# Altium schematic sheet main.SchDoc
size A4
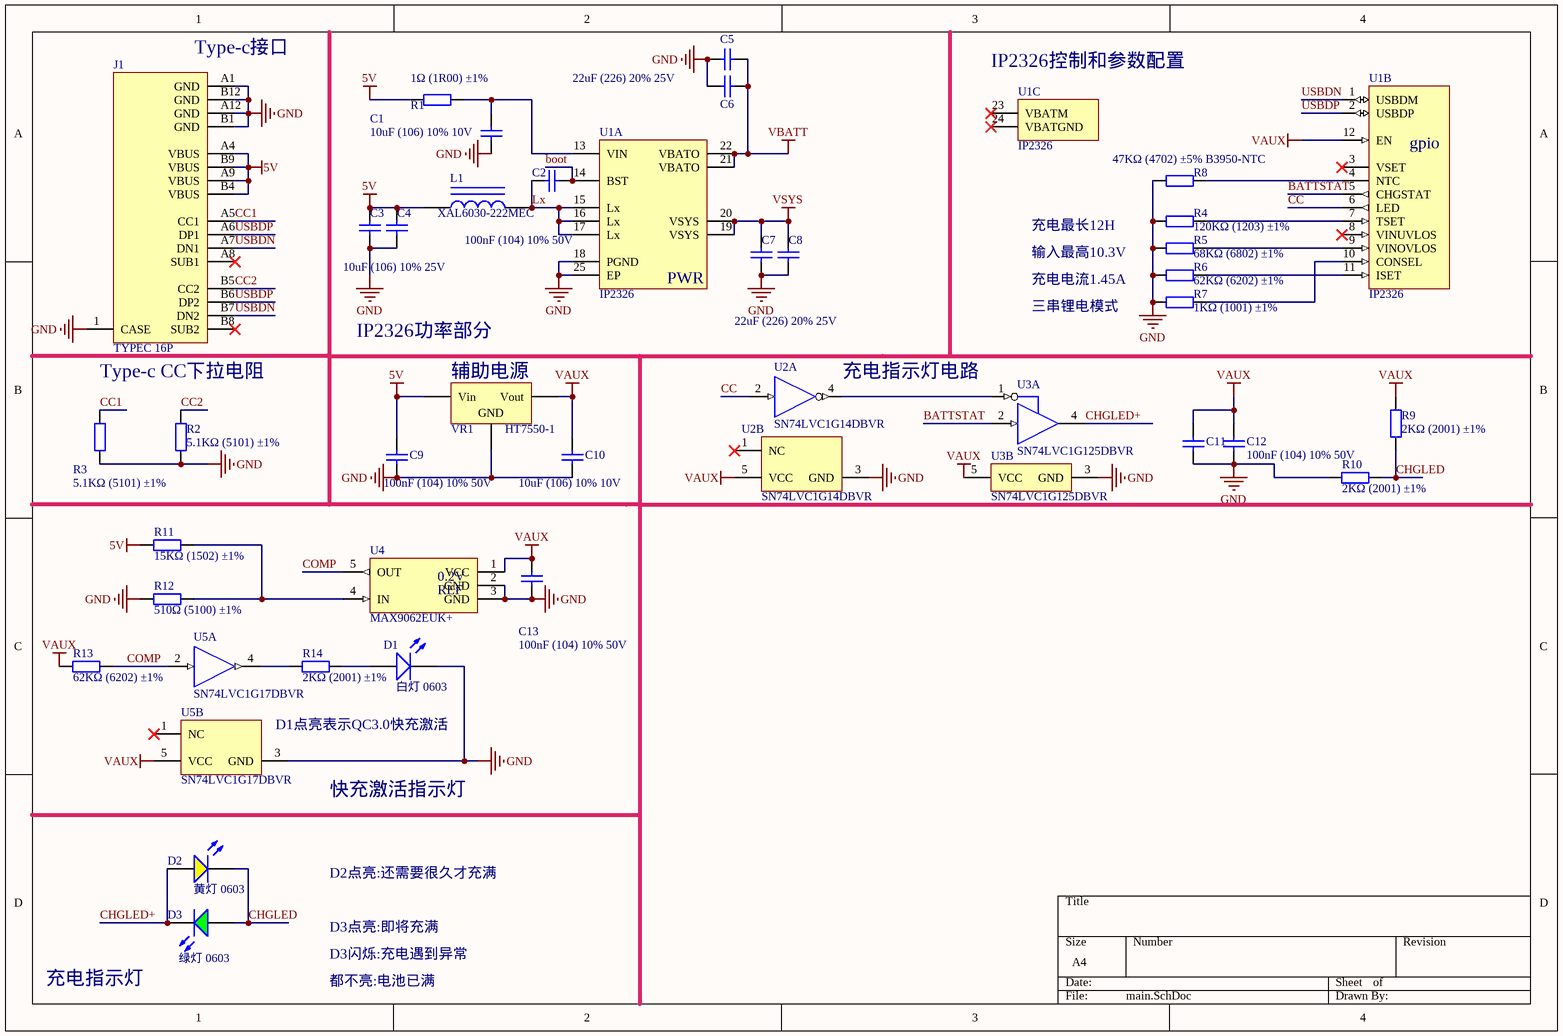
[diagram p0: main.SchDoc]

## Parts
C1  10uF (106) 10% 10V  [0603_C]
C2  100nF (104) 10% 50V  [0603_C]
C3  10uF (106) 10% 25V  [0805_C]  (value not drawn)
C4  10uF (106) 10% 25V  [0805_C]
C5  22uF (226) 20% 25V  [0805_C]
C6  22uF (226) 20% 25V  [0805_C]  (value not drawn)
C7  22uF (226) 20% 25V  [0805_C]  (value not drawn)
C8  22uF (226) 20% 25V  [0805_C]
C9  100nF (104) 10% 50V  [0603_C]
C10  10uF (106) 10% 10V  [0603_C]
C11  100nF (104) 10% 50V  [0603_C]  (value not drawn)
C12  100nF (104) 10% 50V  [0603_C]
C13  100nF (104) 10% 50V  [0603_C]
D1  白灯 0603  [0603_LED_S1]
D2  黄灯 0603  [0603_LED_S1]
D3  绿灯 0603  [0603_LED_S1]
J1  TYPEC 16P  [USB-C-SMD_KH-TYPE-C-16P]
L1  XAL6030-222MEC  [XAL6030-xxxME]
R1  1Ω (1R00) ±1%  [0603_R]
R2  5.1KΩ (5101) ±1%  [0603_R]
R3  5.1KΩ (5101) ±1%  [0603_R]
R4  120KΩ (1203) ±1%  [0603_R]
R5  68KΩ (6802) ±1%  [0603_R]
R6  62KΩ (6202) ±1%  [0603_R]
R7  1KΩ (1001) ±1%  [0603_R]
R8  47KΩ (4702) ±5% B3950-NTC  [0603_R]
R9  2KΩ (2001) ±1%  [0603_R]
R10  2KΩ (2001) ±1%  [0603_R]
R11  15KΩ (1502) ±1%  [0603_R]
R12  510Ω (5100) ±1%  [0603_R]
R13  62KΩ (6202) ±1%  [0603_R]
R14  2KΩ (2001) ±1%  [0603_R]
U1  IP2326  [QFN50P400X400X80_HS-25M]  (parts A,B,C of 3)
U2  SN74LVC1G14DBVR  [DBV0005A_N]  (parts A,B of 2)
U3  SN74LVC1G125DBVR  [DBV0005A_N]  (parts A,B of 2)
U4  MAX9062EUK+  [SOT95P245X110-5N]
U5  SN74LVC1G17DBVR  [DBV0005A_N]  (parts A,B of 2)
VR1  HT7550-1  [SOT-89(SOT-89-3)]

## Nets
5V: C3.2 C4.2 C9.2 J1.A4(VBUS) J1.A9(VBUS) J1.B4(VBUS) J1.B9(VBUS) L1.1 R1.1 R11.1 VR1.2(Vin)
GND: C1.1 C3.1 C4.1 C5.2 C6.1 C7.1 C8.1 C9.1 C10.1 C11.1 C12.1 C13.1 D1.K J1.1(CASE) J1.A1(GND) J1.A12(GND) J1.B1(GND) J1.B12(GND) R2.1 R3.1 R4.1 R5.1 R6.1 R7.1 R8.1 R10.2 R12.1 U1.18(PGND) U1.25(EP) U2.3(GND) U3.3(GND) U4.2(GND) U4.3(GND) U5.3(GND) VR1.1(GND)
VAUX: C10.2 C11.2 C12.2 C13.2 R9.2 R13.2 U1.12(EN) U2.5(VCC) U3.5(VCC) U4.1(VCC) U5.5(VCC) VR1.3(Vout)
VBATT: C5.1 C6.2 U1.21(VBATO) U1.22(VBATO)
VSYS: C7.2 C8.2 U1.19(VSYS) U1.20(VSYS)
BATTSTAT: U1.5(CHGSTAT) U3.2(A)
boot: C2.2 U1.14(BST)
CC: U1.6(LED) U2.2(A)
CC1: J1.A5(CC1) R3.2
CC2: J1.B5(CC2) R2.2
CHGLED: D2.K D3.A R9.1 R10.1
CHGLED+: D2.A D3.K U3.4(Y)
COMP: R13.1 U4.5(OUT) U5.2(A)
Lx: C2.1 L1.2 U1.15(Lx) U1.16(Lx) U1.17(Lx)
USBDN: J1.A7(DN1) J1.B7(DN2) U1.1(USBDM)
USBDP: J1.A6(DP1) J1.B6(DP2) U1.2(USBDP)
NetC1_2: C1.2 R1.2 U1.13(VIN)
NetD1_A: D1.A R14.2
NetR4_2: R4.2 U1.7(TSET)
NetR5_2: R5.2 U1.9(VINOVLOS)
NetR6_2: R6.2 U1.11(ISET)
NetR7_2: R7.2 U1.10(CONSEL)
NetR8_2: R8.2 U1.4(NTC)
NetR11_2: R11.2 R12.2 U4.4(IN)
NetR14_1: R14.1 U5.4(Y)
NetU2_4: U2.4(Y) U3.1(~{OE})

Not connected (* = marked no-connect by the designer): J1 A8(SUB1)* B8(SUB2)*; U1 3(VSET)* 8(VINUVLOS)* 23(VBATM)* 24(VBATGND)*; U2 1(NC)*; U5 1(NC)*

## Notes on the sheet
- (near J1) Type-c接口
- (near U1) IP2326控制和参数配置
- 充电最长12H
- 输入最高10.3V
- 充电电流1.45A
- 三串锂电模式
- Type-c CC下拉电阻
- IP2326功率部分
- (near VR1) 辅助电源
- (near U2) 充电指示灯电路
- (near U5) D1点亮表示QC3.0快充激活
- 快充激活指示灯
- D2点亮:还需要很久才充满
- 充电指示灯
- D3点亮:即将充满
- D3闪烁:充电遇到异常
- 都不亮:电池已满
- (in symbol IP2326, part A) PWR
- (in symbol IP2326, part B) gpio
- (in symbol MAX9062) 0.2V; REF

## Library data of the parts
C1 C10 = 0603 10uF (106) 10% 10V: 贴片电容; ComponentLink1Description: 供应商链接; ComponentLink1URL: http://www.szlcsc.com/product/details_20411.html; Package: 0603; Supplier: LC; SuppliersPartNumber: C19702
C2 C9 C11-C13 = 0603 100nF (104) 10% 50V: 贴片电容; ComponentLink1Description: 供应商链接; ComponentLink1URL: http://www.szlcsc.com/product/details_15331.html; Package: 0603; Supplier: LC; SuppliersPartNumber: C14663
C3 C4 = 0805 10uF (106) 10% 25V: 贴片电容; ComponentLink1Description: 供应商链接; ComponentLink1URL: http://www.szlcsc.com/product/details_16532.html; Package: 0805; Supplier: LC; SuppliersPartNumber: C15850
C5-C8 = 0805 22uF (226) 20% 25V: 贴片电容; ComponentLink1Description: 供应商链接; ComponentLink1URL: http://www.szlcsc.com/product/details_46786.html; Package: 0805; Supplier: LC; SuppliersPartNumber: C45783
D1 = 0603 白灯: 发光二极管; ComponentLink1Description: 供应商链接; ComponentLink1URL: http://www.szlcsc.com/product/details_2663.html; Package: 0603; Supplier: LC; SuppliersPartNumber: C2290
D2 = 0603 黄灯: 发光二极管; ComponentLink1Description: 供应商链接; ComponentLink1URL: http://www.szlcsc.com/product/details_73147.html; Package: 0603; Supplier: LC; SuppliersPartNumber: C72038
D3 = 0603 绿灯: 发光二极管; ComponentLink1Description: 供应商链接; ComponentLink1URL: http://www.szlcsc.com/product/details_73152.html; Package: 0603; Supplier: LC; SuppliersPartNumber: C72043
J1 = KH-TYPEC-16P: 16Pin TypeC立贴座子
L1 = Inductor Iron: Magnetic-Core Inductor; Value: 10mH; Published: 24-Mar-1999; LatestRevisionDate: 17-Jul-2002; LatestRevisionNote: Re-released for DXP Platform.; PackageReference: AXIAL-0.9; Publisher: Altium Limited; PackageDescription: Axial Device, Thru-Hole; 2 Leads; 0.9 in Pin Spacing
R1 = 0603 1Ω (1R00) 1%: 贴片电阻; ComponentLink1Description: 供应商链接; ComponentLink1URL: http://www.szlcsc.com/product/details_23663.html; Package: 0603; Supplier: LC; SuppliersPartNumber: C22936
R2 R3 = 0603 5.1KΩ (5101) 1%: 贴片电阻; ComponentLink1Description: 供应商链接; ComponentLink1URL: http://www.szlcsc.com/product/details_23913.html; Package: 0603; Supplier: LC; SuppliersPartNumber: C23186
R4 = 0603 120KΩ (1203) 1%: 贴片电阻; ComponentLink1Description: 供应商链接; ComponentLink1URL: http://www.szlcsc.com/product/details_26551.html; Package: 0603; Supplier: LC; SuppliersPartNumber: C25808
R5 = 0603 68KΩ (6802) 1%: 贴片电阻; ComponentLink1Description: 供应商链接; ComponentLink1URL: http://www.szlcsc.com/product/details_23958.html; Package: 0603; Supplier: LC; SuppliersPartNumber: C23231
R6 R13 = 0603 62KΩ (6202) 1%: 贴片电阻; ComponentLink1Description: 供应商链接; ComponentLink1URL: http://www.szlcsc.com/product/details_23948.html; Package: 0603; Supplier: LC; SuppliersPartNumber: C23221
R7 = 0603 1KΩ (1001) 1%: 贴片电阻; ComponentLink1Description: 供应商链接; ComponentLink1URL: http://www.szlcsc.com/product/details_21904.html; Package: 0603; Supplier: LC; SuppliersPartNumber: C21190
R8 = 0603 100KΩ (1003) 1%: 贴片NTC热敏电阻; ComponentLink1Description: 供应商链接; ComponentLink1URL: http://www.szlcsc.com/product/details_26546.html; Package: 0603; Supplier: LC; SuppliersPartNumber: C????????
R9 R10 R14 = 0603 2KΩ (2001) 1%: 贴片电阻; ComponentLink1Description: 供应商链接; ComponentLink1URL: http://www.szlcsc.com/product/details_23702.html; Package: 0603; Supplier: LC; SuppliersPartNumber: C22975
R11 = 0603 15KΩ (1502) 1%: 贴片电阻; ComponentLink1Description: 供应商链接; ComponentLink1URL: http://www.szlcsc.com/product/details_23536.html; Package: 0603; Supplier: LC; SuppliersPartNumber: C22809
R12 = 0603 510Ω (5100) 1%: 贴片电阻; ComponentLink1Description: 供应商链接; ComponentLink1URL: http://www.szlcsc.com/product/details_23920.html; Package: 0603; Supplier: LC; SuppliersPartNumber: C23193
U1 = IP2326: 1.5A 2/3S Li-ION Battery charger
U2 = SN74LVC1G14DBVR: Single Schmitt-Trigger Inverter, DBV0005A, LARGE T&R; Manufacturer: Texas Instruments; VCC(Min)(V): 1.65; VCC(Max)(V): 5.5; Output Type: CMOS; ICC @ Nom Voltage(Max)(mA): 0.01; Input Type: CMOS/TTL; Bits(#): 1; F @ Nom Voltage(Max)(Mhz): 150; Rating: Catalog; Technology Family: LVC; Voltage(Nom)(V): 1.8,2.5,3.3,5; Schmitt Trigger: Yes; Output Drive (IOL/IOH)(Max)(mA): 32/-32; tpd @ Nom Voltage(Max)(ns): 11,6.5,5.5,5; Logic: Inverting; Sub-Family: Inverting Buffer/Driver; 3-State Output: No; DatasheetVersion: SCES218W; PackageReference: DBV0005A; Supplier 1: Mouser; Supplier Part Number 1: 595-SN74LVC1G14DBVR; Supplier 2: Digi-Key; Supplier Part Number 2: 296-11607-2-ND; Supplier 3: Digi-Key; Supplier Part Number 3: 296-11607-1-ND; Supplier 4: Digi-Key; Supplier Part Number 4: 296-11607-6-ND; Generic Part Number: SN74LVC1G14; Operating Temperature Range(C): -40 to 125,-40 to 85; PartNumber: SN74LVC1G14DBVR; ComponentLink1Description: Manufacturer URL; ComponentLink1URL: http://www.ti.com/; ComponentLink2Description: Datasheet; ComponentLink2URL: http://www.ti.com/lit/ds/symlink/sn74lvc1g14.pdf
U3 = SN74LVC1G125DBVR: Single Bus Buffer Gate With 3-State Outputs, DBV0005A, LARGE T&R; Manufacturer: Texas Instruments; VCC(Min)(V): 1.65; VCC(Max)(V): 5.5; Output Type: CMOS; ICC @ Nom Voltage(Max)(mA): 0.01; Input Type: CMOS/TTL; Bits(#): 1; F @ Nom Voltage(Max)(Mhz): 150; Rating: Catalog; Technology Family: LVC; Voltage(Nom)(V): 1.8,2.5,3.3,5; Schmitt Trigger: No; Output Drive (IOL/IOH)(Max)(mA): 32/-32; tpd @ Nom Voltage(Max)(ns): 9,5.5,4.5,4; Logic: True; Sub-Family: Non-Inverting Buffer/Driver; 3-State Output: Yes; DatasheetVersion: SCES223T; PackageReference: DBV0005A; Supplier 1: Mouser; Supplier Part Number 1: 595-SN74LVC1G125DBVR; Supplier 2: Digi-Key; Supplier Part Number 2: 296-11603-2-ND; Supplier 3: Digi-Key; Supplier Part Number 3: 296-11603-1-ND; Supplier 4: Digi-Key; Supplier Part Number 4: 296-11603-6-ND; Generic Part Number: SN74LVC1G125; Operating Temperature Range(C): -40 to 125,-40 to 85; PartNumber: SN74LVC1G125DBVR; ComponentLink1Description: Manufacturer URL; ComponentLink1URL: http://www.ti.com/; ComponentLink2Description: Datasheet; ComponentLink2URL: http://www.ti.com/lit/ds/symlink/sn74lvc1g125.pdf
U4 = MAX9062: tiny Comparator with 0.2V Ref OD Output
U5 = SN74LVC1G17DBVR: Single Schmitt-Trigger Buffer, DBV0005A, LARGE T&R; Manufacturer: Texas Instruments; VCC(Min)(V): 1.65; VCC(Max)(V): 5.5; Output Type: CMOS; ICC @ Nom Voltage(Max)(mA): 0.01; Input Type: CMOS/TTL; Bits(#): 1; F @ Nom Voltage(Max)(Mhz): 150; Rating: Catalog; Technology Family: LVC; Voltage(Nom)(V): 1.8,2.5,3.3,5; Schmitt Trigger: Yes; Output Drive (IOL/IOH)(Max)(mA): 32/-32; tpd @ Nom Voltage(Max)(ns): 11,6.5,5.5,5; Logic: True; Sub-Family: Non-Inverting Buffer/Driver; 3-State Output: No; DatasheetVersion: SCES351V; PackageReference: DBV0005A; Supplier 1: Mouser; Supplier Part Number 1: 595-SN74LVC1G17DBVR; Supplier 2: Digi-Key; Supplier Part Number 2: 296-11933-2-ND; Supplier 3: Digi-Key; Supplier Part Number 3: 296-11933-1-ND; Supplier 4: Digi-Key; Supplier Part Number 4: 296-11933-6-ND; Generic Part Number: SN74LVC1G17; Operating Temperature Range(C): -40 to 125,-40 to 85; PartNumber: SN74LVC1G17DBVR; ComponentLink1Description: Manufacturer URL; ComponentLink1URL: http://www.ti.com/; ComponentLink2Description: Datasheet; ComponentLink2URL: http://www.ti.com/lit/ds/symlink/sn74lvc1g17.pdf
VR1 = SOT-89 HT7550-1: 低压差线性稳压(LDO); ComponentLink1Description: 供应商链接; ComponentLink1URL: http://www.szlcsc.com/product/details_16788.html; Package: SOT-89; Supplier: LC; SuppliersPartNumber: C16106